# EAGLE design qo-100-digital-rf-power-meter (EAGLE 9.6.1)
CNAME: None; CREVISION: 1; DESIGNER: Joao Silva
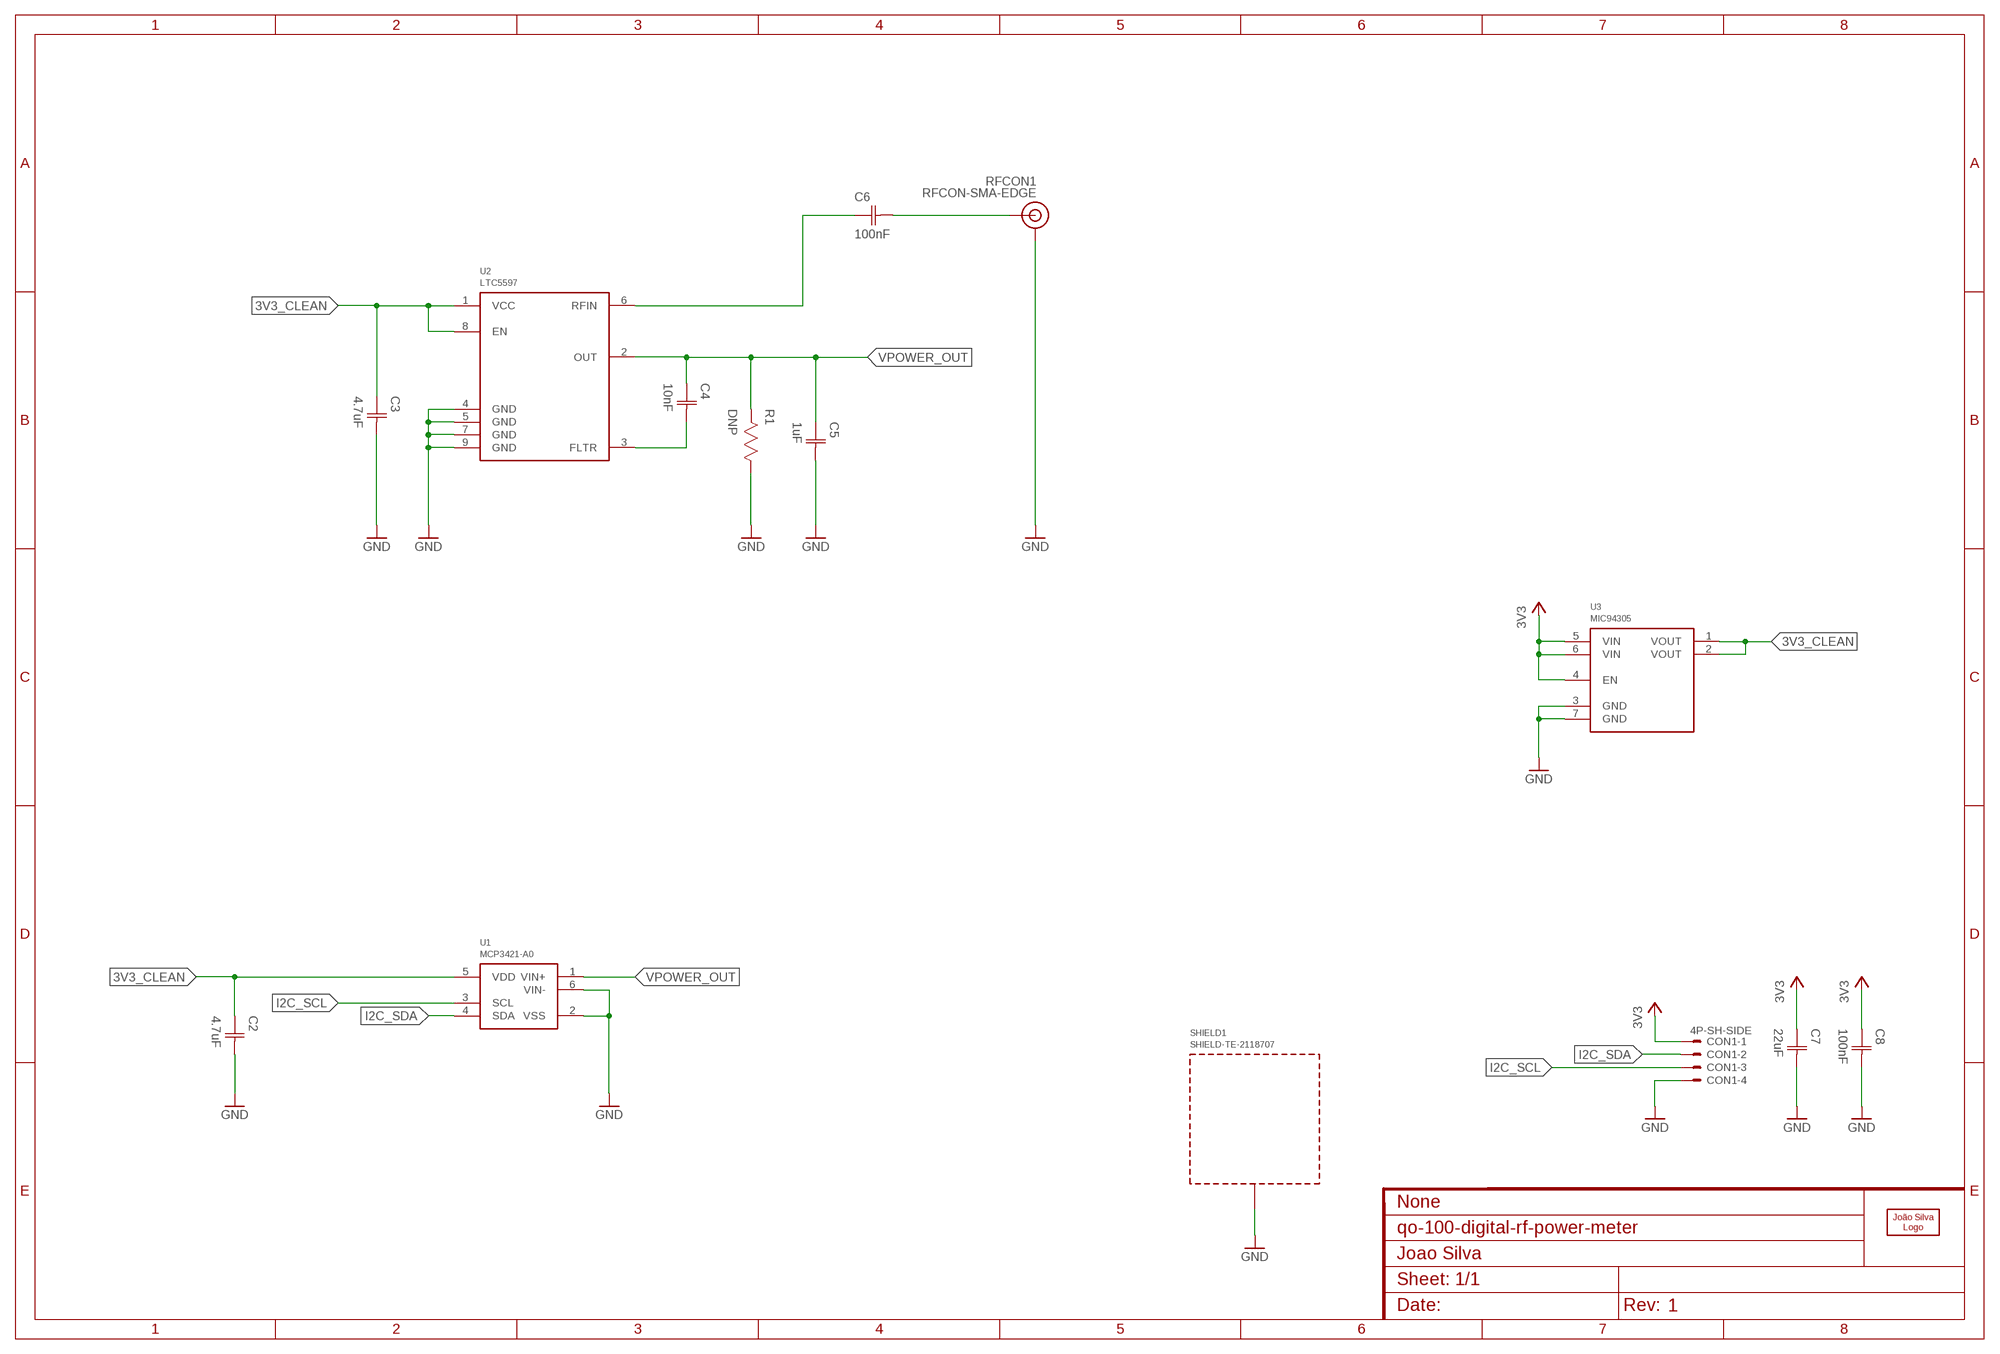
[diagram p0: schematic, sheet 1]

## Parts
C2  4.7uF  CAPACITOR-0603  [CAP0603]
C3  4.7uF  CAPACITOR-0603  [CAP0603]
C4  10nF  CAPACITOR-0603  [CAP0603]
C5  1uF  CAPACITOR-0603  [CAP0603]
C6  100nF  CAPACITOR-0603  [CAP0603]
C7  22uF  CAPACITOR-1206  [CAP1206]
C8  100nF  CAPACITOR-0603  [CAP0603]
CON1  4P-SH-SIDE  [SH-04-SIDE]
LOGO1  JS-5MM  [JS_5MM]
R1  DNP  RESISTOR-0603  [RES0603]
RFCON1  RFCON-SMA-EDGE  [SMA-EDGE]
SHIELD1  SHIELD-TE-2118707  [2118707]
U1  MCP3421-A0  [SOT23-6]
U2  LTC5597  [DFN8_2X2]
U3  MIC94305  [DFN6]

## Nets
3V3: C7.1(C1) C8.1(C1) CON1.1 U3.4(EN) U3.5(VIN) U3.6(VIN)
3V3_CLEAN: C2.1(C1) C3.1(C1) U1.5(VDD) U2.1(VCC) U2.8(EN) U3.1(VOUT) U3.2(VOUT)
GND: C2.2(C2) C3.2(C2) C5.2(C2) C7.2(C2) C8.2(C2) CON1.4 R1.1 RFCON1.GND@0(GND) RFCON1.GND@1(GND) RFCON1.GND@2(GND) RFCON1.GND@3(GND) SHIELD1.1(GND) SHIELD1.2(GND) SHIELD1.3(GND) SHIELD1.4(GND) SHIELD1.5(GND) SHIELD1.6(GND) SHIELD1.7(GND) SHIELD1.8(GND) SHIELD1.9(GND) SHIELD1.10(GND) SHIELD1.11(GND) SHIELD1.12(GND) U1.2(VSS) U1.6(VIN-) U2.4(GND) U2.5(GND) U2.7(GND) U2.9(GND) U3.3(GND) U3.7(GND)
I2C_SCL: CON1.3 U1.3(SCL)
I2C_SDA: CON1.2 U1.4(SDA)
N$1: C6.1(C1) U2.6(RFIN)
N$2: C6.2(C2) RFCON1.SIG(SIGNAL)
N$3: C4.2(C2) U2.3(FLTR)
VPOWER_OUT: C4.1(C1) C5.1(C1) R1.2 U1.1(VIN+) U2.2(OUT)

## Library data of the parts
C2-C8 = Capacitor:CAPACITOR
CON1 = JST:4P: Disconnectable Crimp style connector, 1.0mm pitch 4 contacts
LOGO1 = Silkscreen:JS
R1 = Resistor:RESISTOR
RFCON1 = RF Connector:RFCON
SHIELD1 = Shield:SHIELD
U1 = Microchip:MCP3421-A*
U2 = Analog Devices:LTC5597
U3 = Microchip:MIC94305

## Board
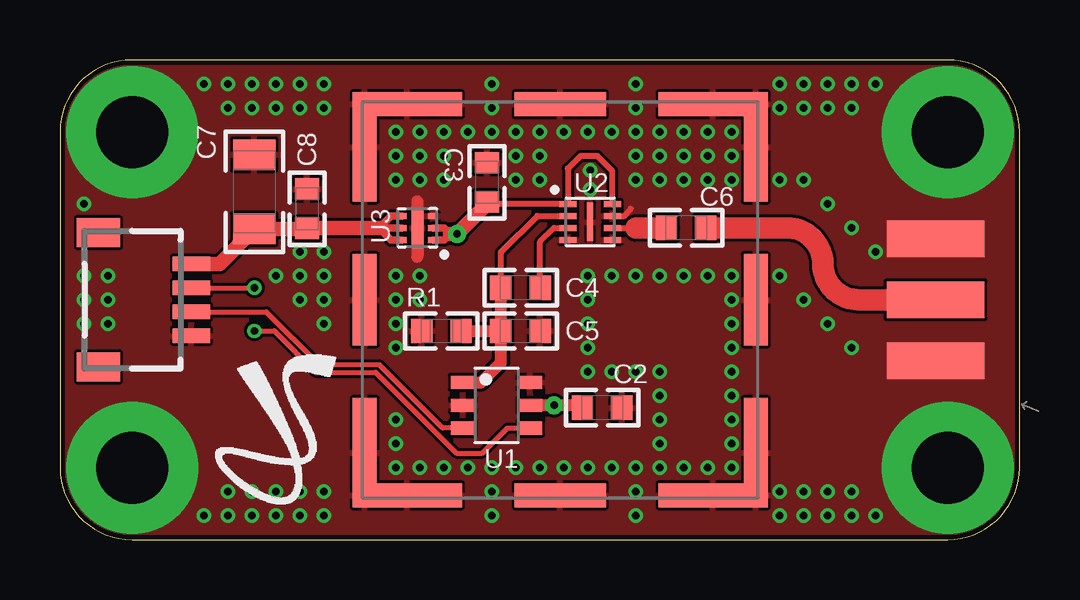
[diagram p1: board, top side]
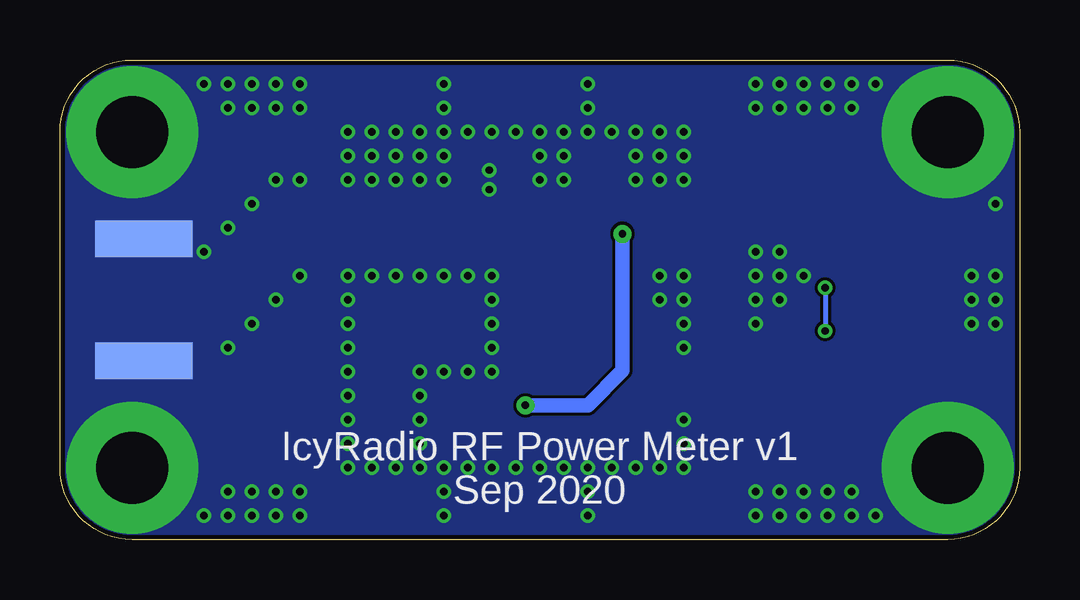
[diagram p2: board, bottom side, seen from below]

Size 40 x 20 mm. Coordinates in mm from the lower left corner, seen from the top.
Outline: 0,17 0,3 arc90 3,0 37,0 arc90 40,3 40,17 arc90 37,20 3,20 arc90 0,17
Copper layers (1*16): Top 0.035mm / dielectric 1.6mm / Bottom 0.035mm
Design rules "jlcpcb_2layer": minimum track width 5mil, minimum drill 0.3mm, track to track 5mil, track to pad 5mil, pad to pad 5mil, via to via 5mil, smd to smd 5mil, copper to edge 0.2mm, drill to drill 5mil, minimum pad ring 3mil, minimum via ring 3mil, stop-mask expansion 0.075mm, vias tented up to drill 10mm, thermal gap 5mil

### Footprints (pad centres in the part's own frame; a part is rotated, then mirrored left to right if it is on the bottom)
CAP0603 = smd 0.889 x 1.016: 1 -0.819,0; 2 0.819,0
CAP1206 = smd 1.27 x 1.778: 1 -1.549,0; 2 1.549,0
SH-04-SIDE = smd 0.6 x 1.55: 1 -1.5,2.975; 2 -0.5,2.975; 3 0.5,2.975; 4 1.5,2.975 | smd 1.2 x 1.8: FIT@1 -2.8,-0.9; FIT@2 2.8,-0.9
RES0603 = smd 0.889 x 1.016: 1 -0.819,0; 2 0.819,0
SMA-EDGE = smd 1.524 x 4.064: GND@0 -2.54,0; GND@1 2.54,0; SIG 0,0 | smd 1.524 x 4.064 bottom: GND@2 -2.54,0; GND@3 2.54,0
2118707 = smd 4.55 x 1: 1 2.275,0.5; 3 15.025,0.5; 7 2.275,16.8; 9 15.025,16.8 | smd 3.8 x 1: 2 8.65,0.5; 8 8.65,16.8 | smd 1 x 4.55: 4 16.8,2.275; 6 16.8,15.025; 10 0.5,2.275; 12 0.5,15.025 | smd 1 x 3.8: 5 16.8,8.65; 11 0.5,8.65
SOT23-6 = smd 1 x 0.55: 1 -1.4,0.95; 2 -1.4,0; 3 -1.4,-0.95; 4 1.4,-0.95; 5 1.4,0; 6 1.4,0.95
DFN8_2X2 = smd 0.7 x 0.25: 1 -0.925,0.75; 2 -0.925,0.25; 3 -0.925,-0.25; 4 -0.925,-0.75; 5 0.925,-0.75; 6 0.925,-0.25; 7 0.925,0.25; 8 0.925,0.75 | smd 0.25 x 1.6: 9 0,0
DFN6 = smd 0.25 x 0.4: 1 -0.5,-0.65; 2 0,-0.65; 3 0.5,-0.65; 4 0.5,0.65; 5 0,0.65; 6 -0.5,0.65 | smd 1.4 x 0.5: 7 0,0

### Placement (x,y rotation side)
C2  22.6,5.5 0 top
C3  17.8,14.9 90 top
C4  19.2,10.5 0 top
C5  19.2,8.7 0 top
C6  26.1,13 0 top
C7  8.1,14.5 90 top
C8  10.3,13.8 90 top
CON1  2.5,10 270 top
LOGO1  11.7,7.9 0 top
R1  15.9,8.7 0 top
RFCON1  36.5,10 90 top
SHIELD1  12.2,1.35 0 top
U1  18.2,5.6 0 top
U2  22.1,13.25 0 top
U3  14.9,13 90 top

### Tracks (layer width: path | path; a pad name or v marks a point on that pad's centre or on a via)
3V3
  Top 0.305: U3.6 13.8,12.5 13.3,13 | 13.3,13 U3.5 | U3.4 13.8,13.5 13.3,13
  Top 0.61: CON1.1 6.65,11.5 C7.1 10.27,12.95 C8.1 10.32,13 13.3,13
3V3_CLEAN  (via drill 0.3 pad 0.75)
  Top 0.254: C3.1 17.88,14 U2.1 21.18,15.47 21.7,16 22.4,16 23.02,15.38 U2.8
  Top 0.305: U3.2 16,13 16.25,12.75 16,12.5 U3.1
  Top 0.508: U1.5 v20.6,5.6 21.68,5.6 C2.1
  Top 0.61: C3.1 17.8,14 v16.55,12.75 16.25,12.75
  Bottom 0.61: v20.6,5.6 18,5.6 16.55,7.05 v16.55,12.75
GND  (via drill 0.3, 3 pad 5.5)
  Top 0.254: U2.7 23.5,13.5 23.8,13.8
  Top 0.508: 14.9,14.1 U3.7 14.9,11.8
  other vias: 10,10 11,9 11,10 11,11 11,12 10,12 10,11 9,11 8,1 8,2 7,2 6,1 7,1 11,2 11,1 9,1 10,1 10,2 9,2 24,1 24,2 18,1 18,2 32,1 32,2 31,2 30,2 30,1 31,1 33,1 34,1 33,2 1,14 2,9 1,9 1,10 2,10 2,11 1,11 34,19 31,18 31,19 33,19 32,19 32,18 33,18 18,19 18,18 24,19 24,18 10,19 10,18 11,18 11,19 7,18 7,19 6,19 9,19 8,19 8,18 9,18 30,19 30,18 26,11 25,11 24,11 23,11 22,11 22,10 27,11 25,6 25,5 25,4 26,3 27,3 25,7 22,8 24,7 22,9 22,7 23,7 26,17 25,17 24,17 27,17 26,16 25,16 25,15 26,15 24,15 24,16 27,16 27,15 22,17 21,17 20,17 23,17 18,17 17,17 16,17 19,17 28,16 28,15 28,17 24,3 25,3 21,3 22,3 23,3 18,3 19,3 20,3 15,3 16,3 17,3 14,3 14,4 14,5 14,8 14,9 14,10 14,11 14,15 14,16 14,17 15,17 15,16 15,15 22.1,14.6 28,11 28,10 28,5 28,6 28,4 28,3 28,7 28,9 28,8 33,13 34,12 32,14 31,15 30,15 30,11 31,10 32,9 33,8 37,3 3,3 3,17 37,17 22.1,15.4 16,16 16,15 19,16 19,15 20,16 20,15 15,10 15,11
  pour Top (rank 6): -1,21 41,21 41,-1 -1,-1
  pour Bottom (rank 6): -2,22 42,22 42,-2 -2,-2
  pour Top (no thermals): 34.1,13.7 38.9,13.7 38.9,13.4 38.9,6.3 34.3,6.3 34.1,6.3
  pour Bottom (no thermals): 34.1,13.7 38.9,13.7 38.9,13.4 38.9,6.3 34.3,6.3 34.1,6.3
I2C_SCL
  Top 0.2: CON1.3 8.6,9.5 10.8,7.3 13.3,7.3 15.95,4.65 U1.3
I2C_SDA  (via drill 0.3)
  Top 0.2: CON1.2 v8.1,10.5 | v8.1,8.7 8.94,8.7 10.66,6.97 13.16,6.97 16.54,3.6 17.6,3.6 18.65,4.65 U1.4
  Bottom 0.2: v8.1,10.5 v8.1,8.7
N$1
  Top 0.254: U2.6 24,13
  Top 0.9: 24,13 C6.1
N$2
  Top 0.9: RFCON1.SIG 33.3,10 arc-90 31.8,11.5 arc90 30.3,13 C6.2
N$3
  Top 0.254: C4.2 20.02,12.42 20.6,13 U2.3
VPOWER_OUT
  Top 0.254: C4.1 18.38,11.98 19.9,13.5 U2.2
  Top 0.508: U1.1 17.55,6.55 18.38,7.38 C5.1 | C5.1 C4.1 | R1.2 C5.1

### Text on the board
bPlace: IcyRadio RF Power Meter v1 / Sep 2020